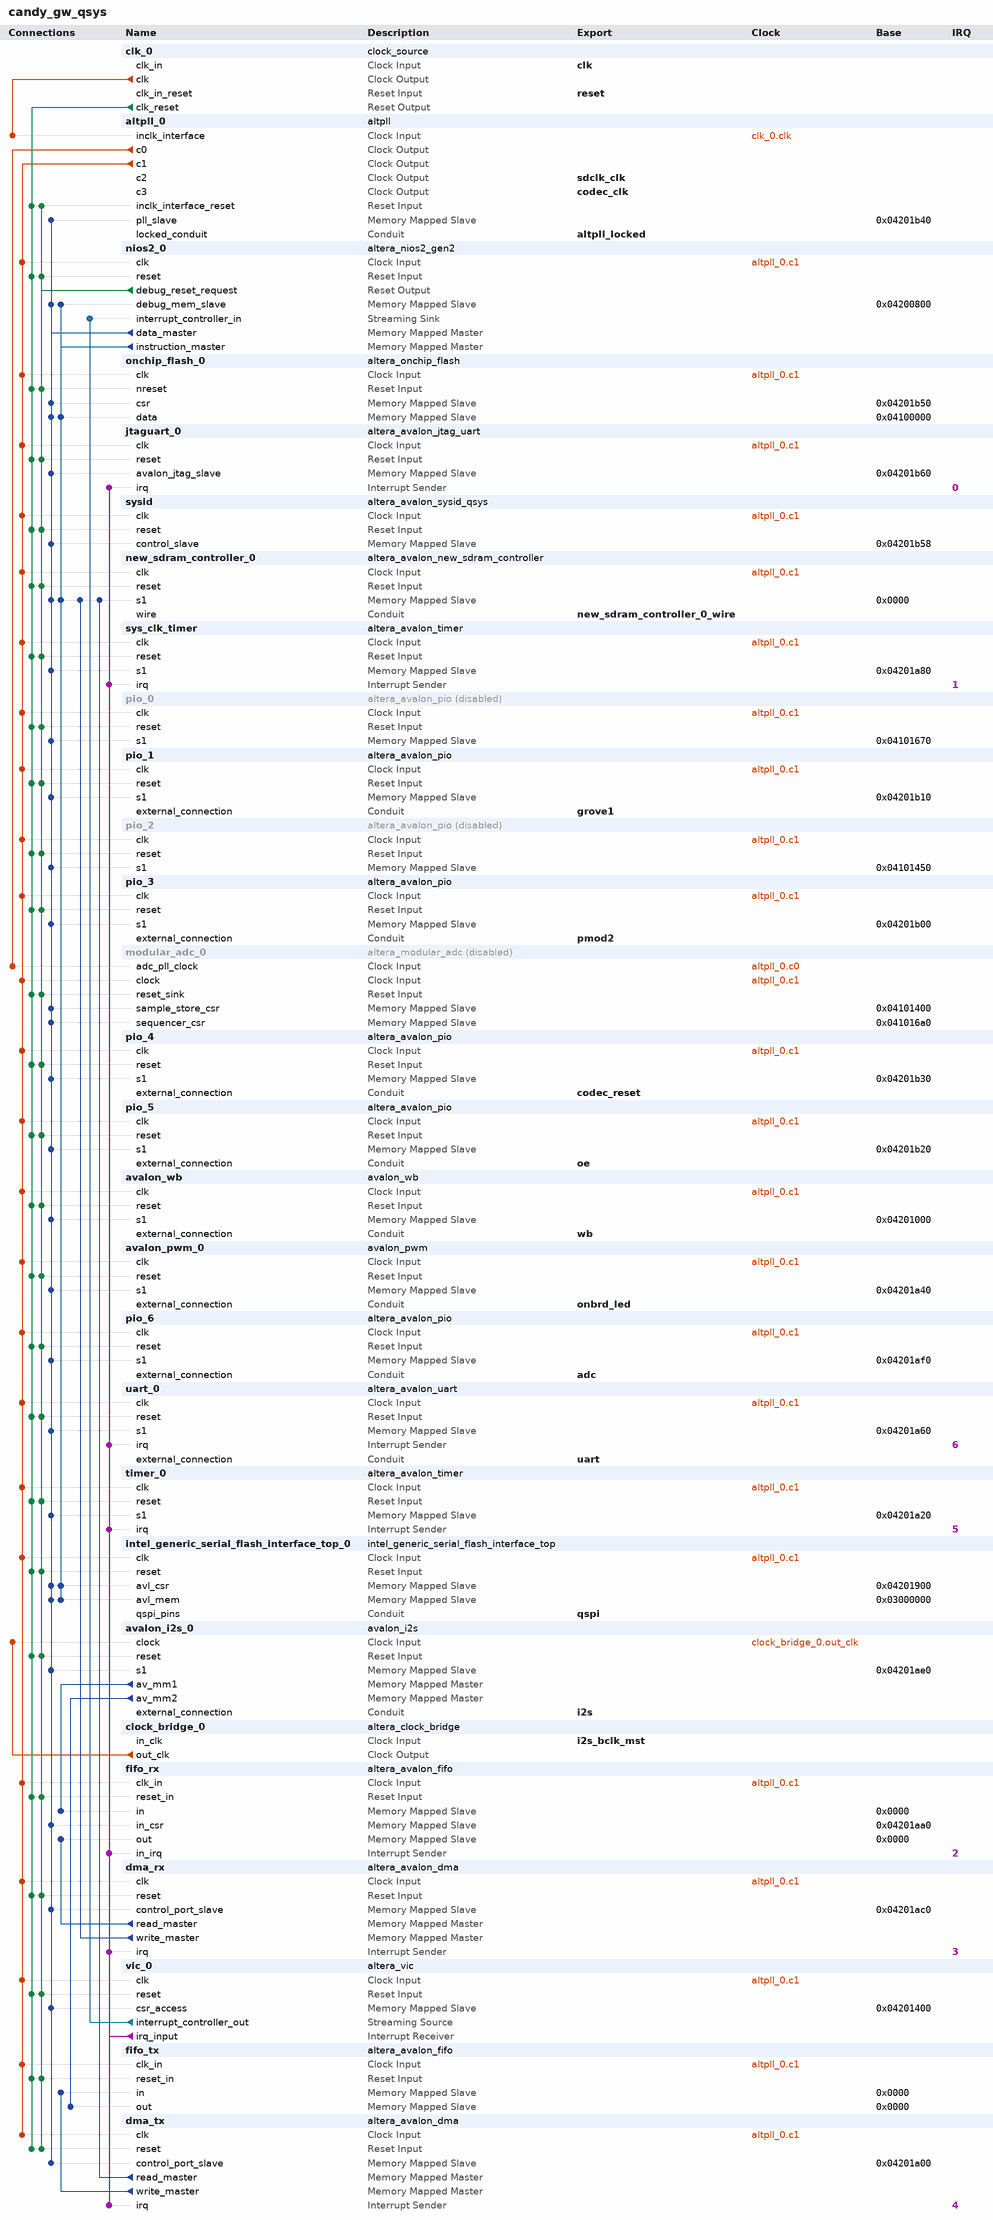
[diagram p0: system contents]
# Platform Designer (Qsys) system candy_gw_qsys, MAX 10 10M16SAU169C8G
# Parameters at their usual value, and those the tool derives, are not listed.
package require -exact qsys 18.1
create_system candy_gw_qsys
set_project_property DEVICE_FAMILY {MAX 10}
set_project_property DEVICE 10M16SAU169C8G

add_instance clk_0 clock_source 18.1
set_instance_parameter_value clk_0 clockFrequency 48000000

add_instance altpll_0 altpll 18.1
set_instance_parameter_value altpll_0 CLK0_DIVIDE_BY 24
set_instance_parameter_value altpll_0 CLK0_MULTIPLY_BY 5
set_instance_parameter_value altpll_0 CLK1_DIVIDE_BY 12
set_instance_parameter_value altpll_0 CLK1_DUTY_CYCLE 50
set_instance_parameter_value altpll_0 CLK1_MULTIPLY_BY 25
set_instance_parameter_value altpll_0 CLK1_PHASE_SHIFT 0
set_instance_parameter_value altpll_0 CLK2_DIVIDE_BY 12
set_instance_parameter_value altpll_0 CLK2_DUTY_CYCLE 50
set_instance_parameter_value altpll_0 CLK2_MULTIPLY_BY 25
set_instance_parameter_value altpll_0 CLK2_PHASE_SHIFT -83333
set_instance_parameter_value altpll_0 CLK3_DIVIDE_BY 6
set_instance_parameter_value altpll_0 CLK3_DUTY_CYCLE 50
set_instance_parameter_value altpll_0 CLK3_MULTIPLY_BY 1
set_instance_parameter_value altpll_0 CLK3_PHASE_SHIFT 0
set_instance_parameter_value altpll_0 CLK4_DIVIDE_BY 4
set_instance_parameter_value altpll_0 CLK4_DUTY_CYCLE 50
set_instance_parameter_value altpll_0 CLK4_MULTIPLY_BY 1
set_instance_parameter_value altpll_0 CLK4_PHASE_SHIFT 0
set_instance_parameter_value altpll_0 INCLK0_INPUT_FREQUENCY 20833
set_instance_parameter_value altpll_0 PORT_ARESET PORT_UNUSED
set_instance_parameter_value altpll_0 PORT_LOCKED PORT_USED
set_instance_parameter_value altpll_0 PORT_clk1 PORT_USED
set_instance_parameter_value altpll_0 PORT_clk2 PORT_USED
set_instance_parameter_value altpll_0 PORT_clk3 PORT_USED

add_instance nios2_0 altera_nios2_gen2 18.1
set_instance_parameter_value nios2_0 dcache_size 2048
set_instance_parameter_value nios2_0 exceptionSlave new_sdram_controller_0.s1
set_instance_parameter_value nios2_0 icache_size 4096
set_instance_parameter_value nios2_0 impl Fast
set_instance_parameter_value nios2_0 resetSlave onchip_flash_0.data
set_instance_parameter_value nios2_0 setting_interruptControllerType External
set_instance_parameter_value nios2_0 setting_shadowRegisterSets 7

add_instance onchip_flash_0 altera_onchip_flash 18.1
set_instance_parameter_value onchip_flash_0 CONFIGURATION_MODE {Single Uncompressed Image}
set_instance_parameter_value onchip_flash_0 SECTOR_ACCESS_MODE {Read and write,Read and write,Read and write,Read and write,Read and write}
set_instance_parameter_value onchip_flash_0 initFlashContent false
set_instance_parameter_value onchip_flash_0 initializationFileName altera_onchip_flash.hex
set_instance_parameter_value onchip_flash_0 useNonDefaultInitFile false

add_instance jtaguart_0 altera_avalon_jtag_uart 18.1
set_instance_parameter_value jtaguart_0 simInteractiveOptions NO_INTERACTIVE_WINDOWS

add_instance sysid altera_avalon_sysid_qsys 18.1
set_instance_parameter_value sysid id 549

add_instance new_sdram_controller_0 altera_avalon_new_sdram_controller 18.1
set_instance_parameter_value new_sdram_controller_0 TAC 6.0
set_instance_parameter_value new_sdram_controller_0 TRCD 21.0
set_instance_parameter_value new_sdram_controller_0 TRFC 63.0
set_instance_parameter_value new_sdram_controller_0 TRP 21.0
set_instance_parameter_value new_sdram_controller_0 casLatency 3
set_instance_parameter_value new_sdram_controller_0 columnWidth 9
set_instance_parameter_value new_sdram_controller_0 dataWidth 16
set_instance_parameter_value new_sdram_controller_0 generateSimulationModel false
set_instance_parameter_value new_sdram_controller_0 model single_Micron_MT48LC4M32B2_7_chip
set_instance_parameter_value new_sdram_controller_0 numberOfBanks 4
set_instance_parameter_value new_sdram_controller_0 numberOfChipSelects 1
set_instance_parameter_value new_sdram_controller_0 powerUpDelay 200.0
set_instance_parameter_value new_sdram_controller_0 refreshPeriod 7.8
set_instance_parameter_value new_sdram_controller_0 rowWidth 13

add_instance sys_clk_timer altera_avalon_timer 18.1
set_instance_parameter_value sys_clk_timer fixedPeriod true
set_instance_parameter_value sys_clk_timer period 1
set_instance_parameter_value sys_clk_timer periodUnits MSEC

add_instance pio_0 altera_avalon_pio 18.1
set_instance_property pio_0 ENABLED false
set_instance_parameter_value pio_0 direction Output
set_instance_parameter_value pio_0 width 4

add_instance pio_1 altera_avalon_pio 18.1
set_instance_parameter_value pio_1 direction InOut
set_instance_parameter_value pio_1 width 2

add_instance pio_2 altera_avalon_pio 18.1
set_instance_property pio_2 ENABLED false
set_instance_parameter_value pio_2 direction Output
set_instance_parameter_value pio_2 width 4

add_instance pio_3 altera_avalon_pio 18.1
set_instance_parameter_value pio_3 direction Input
set_instance_parameter_value pio_3 width 4

add_instance modular_adc_0 altera_modular_adc 18.1
set_instance_property modular_adc_0 ENABLED false
set_instance_parameter_value modular_adc_0 CLOCK_FREQ 100000000
set_instance_parameter_value modular_adc_0 CORE_VAR 0
set_instance_parameter_value modular_adc_0 DEVICE_PART 10M16SAU169C8G
set_instance_parameter_value modular_adc_0 clkdiv 2
set_instance_parameter_value modular_adc_0 int_vref_vr 3.3
set_instance_parameter_value modular_adc_0 refsel 1
set_instance_parameter_value modular_adc_0 sample_rate 0
set_instance_parameter_value modular_adc_0 seq_order_length 1
set_instance_parameter_value modular_adc_0 seq_order_slot_1 0
set_instance_parameter_value modular_adc_0 seq_order_slot_2 30
set_instance_parameter_value modular_adc_0 seq_order_slot_3 30
set_instance_parameter_value modular_adc_0 seq_order_slot_4 30
set_instance_parameter_value modular_adc_0 seq_order_slot_5 30
set_instance_parameter_value modular_adc_0 seq_order_slot_6 30
set_instance_parameter_value modular_adc_0 seq_order_slot_7 30
set_instance_parameter_value modular_adc_0 use_ch0 true
set_instance_parameter_value modular_adc_0 use_ch2 true
set_instance_parameter_value modular_adc_0 use_ch3 true
set_instance_parameter_value modular_adc_0 use_ch4 true
set_instance_parameter_value modular_adc_0 use_ch5 true
set_instance_parameter_value modular_adc_0 use_ch6 true
set_instance_parameter_value modular_adc_0 use_ch7 true
set_instance_parameter_value modular_adc_0 use_ch8 true
set_instance_parameter_value modular_adc_0 use_tsd false

add_instance pio_4 altera_avalon_pio 18.1
set_instance_parameter_value pio_4 direction Output
set_instance_parameter_value pio_4 width 1

add_instance pio_5 altera_avalon_pio 18.1
set_instance_parameter_value pio_5 direction Output
set_instance_parameter_value pio_5 width 1

add_instance avalon_wb avalon_wb 1.0

add_instance avalon_pwm_0 avalon_pwm 1.0
set_instance_parameter_value avalon_pwm_0 PWM_COUNTER_MAX 60000
set_instance_parameter_value avalon_pwm_0 WIDTH 3

add_instance pio_6 altera_avalon_pio 18.1
set_instance_parameter_value pio_6 direction Input
set_instance_parameter_value pio_6 width 8

add_instance uart_0 altera_avalon_uart 18.1
set_instance_parameter_value uart_0 baud 115200
set_instance_parameter_value uart_0 dataBits 8
set_instance_parameter_value uart_0 fixedBaud true
set_instance_parameter_value uart_0 parity NONE
set_instance_parameter_value uart_0 stopBits 1
set_instance_parameter_value uart_0 useCtsRts true

add_instance timer_0 altera_avalon_timer 18.1
set_instance_parameter_value timer_0 period 1
set_instance_parameter_value timer_0 periodUnits USEC

add_instance intel_generic_serial_flash_interface_top_0 intel_generic_serial_flash_interface_top 18.1
set_instance_parameter_value intel_generic_serial_flash_interface_top_0 CHIP_SELECT_BYPASS false
set_instance_parameter_value intel_generic_serial_flash_interface_top_0 CHIP_SELS 1
set_instance_parameter_value intel_generic_serial_flash_interface_top_0 DEBUG_OPTION 0
set_instance_parameter_value intel_generic_serial_flash_interface_top_0 DEFAULT_VALUE_REG_0 1
set_instance_parameter_value intel_generic_serial_flash_interface_top_0 DEFAULT_VALUE_REG_1 16
set_instance_parameter_value intel_generic_serial_flash_interface_top_0 DEFAULT_VALUE_REG_2 0
set_instance_parameter_value intel_generic_serial_flash_interface_top_0 DEFAULT_VALUE_REG_3 0
set_instance_parameter_value intel_generic_serial_flash_interface_top_0 DEFAULT_VALUE_REG_4 0
set_instance_parameter_value intel_generic_serial_flash_interface_top_0 DEFAULT_VALUE_REG_5 3
set_instance_parameter_value intel_generic_serial_flash_interface_top_0 DEFAULT_VALUE_REG_6 28674
set_instance_parameter_value intel_generic_serial_flash_interface_top_0 DEFAULT_VALUE_REG_7 6149
set_instance_parameter_value intel_generic_serial_flash_interface_top_0 DEVICE_DENSITY 128
set_instance_parameter_value intel_generic_serial_flash_interface_top_0 ENABLE_SIM_MODEL false
set_instance_parameter_value intel_generic_serial_flash_interface_top_0 PIPE_CMD_GEN_CMD 0
set_instance_parameter_value intel_generic_serial_flash_interface_top_0 PIPE_CSR 0
set_instance_parameter_value intel_generic_serial_flash_interface_top_0 PIPE_MUX_CMD 0
set_instance_parameter_value intel_generic_serial_flash_interface_top_0 PIPE_XIP 0
set_instance_parameter_value intel_generic_serial_flash_interface_top_0 USE_CHIP_SEL_FROM_CSR 1
set_instance_parameter_value intel_generic_serial_flash_interface_top_0 gui_use_asmiblock false
set_instance_parameter_value intel_generic_serial_flash_interface_top_0 gui_use_gpio true

add_instance avalon_i2s_0 avalon_i2s 0.1
set_instance_parameter_value avalon_i2s_0 DATA_WIDTH 32

add_instance clock_bridge_0 altera_clock_bridge 18.1
set_instance_parameter_value clock_bridge_0 DERIVED_CLOCK_RATE 0
set_instance_parameter_value clock_bridge_0 EXPLICIT_CLOCK_RATE 0

add_instance fifo_rx altera_avalon_fifo 18.1
set_instance_parameter_value fifo_rx bitsPerSymbol 8
set_instance_parameter_value fifo_rx channelWidth 0
set_instance_parameter_value fifo_rx errorWidth 0
set_instance_parameter_value fifo_rx fifoDepth 1024
set_instance_parameter_value fifo_rx fifoInputInterfaceOptions AVALONMM_WRITE
set_instance_parameter_value fifo_rx fifoOutputInterfaceOptions AVALONMM_READ
set_instance_parameter_value fifo_rx singleClockMode true
set_instance_parameter_value fifo_rx symbolsPerBeat 4
set_instance_parameter_value fifo_rx useBackpressure false
set_instance_parameter_value fifo_rx useIRQ true
set_instance_parameter_value fifo_rx usePacket false
set_instance_parameter_value fifo_rx useReadControl false

add_instance dma_rx altera_avalon_dma 18.1
set_instance_parameter_value dma_rx allowByteTransactions true
set_instance_parameter_value dma_rx allowDoubleWordTransactions true
set_instance_parameter_value dma_rx allowHalfWordTransactions true
set_instance_parameter_value dma_rx allowQuadWordTransactions true
set_instance_parameter_value dma_rx burstEnable false
set_instance_parameter_value dma_rx fifoDepth 2048
set_instance_parameter_value dma_rx maxBurstSize 128
set_instance_parameter_value dma_rx minimumDmaTransactionRegisterWidth 13

add_instance vic_0 altera_vic 18.1
set_instance_parameter_value vic_0 DAISY_CHAIN_ENABLE 0
set_instance_parameter_value vic_0 INTERRUPT_LATENCY_CYCLES 2
set_instance_parameter_value vic_0 NUMBER_OF_INT_PORTS 7
set_instance_parameter_value vic_0 OVERRIDE_INTERRUPT_LATENCY false
set_instance_parameter_value vic_0 RIL_WIDTH 6

add_instance fifo_tx altera_avalon_fifo 18.1
set_instance_parameter_value fifo_tx bitsPerSymbol 8
set_instance_parameter_value fifo_tx channelWidth 0
set_instance_parameter_value fifo_tx errorWidth 0
set_instance_parameter_value fifo_tx fifoDepth 1024
set_instance_parameter_value fifo_tx fifoInputInterfaceOptions AVALONMM_WRITE
set_instance_parameter_value fifo_tx fifoOutputInterfaceOptions AVALONMM_READ
set_instance_parameter_value fifo_tx singleClockMode true
set_instance_parameter_value fifo_tx symbolsPerBeat 4
set_instance_parameter_value fifo_tx useBackpressure false
set_instance_parameter_value fifo_tx useIRQ true
set_instance_parameter_value fifo_tx usePacket false
set_instance_parameter_value fifo_tx useReadControl false
set_instance_parameter_value fifo_tx useWriteControl false

add_instance dma_tx altera_avalon_dma 18.1
set_instance_parameter_value dma_tx allowByteTransactions true
set_instance_parameter_value dma_tx allowDoubleWordTransactions true
set_instance_parameter_value dma_tx allowHalfWordTransactions true
set_instance_parameter_value dma_tx allowQuadWordTransactions true
set_instance_parameter_value dma_tx burstEnable false
set_instance_parameter_value dma_tx fifoDepth 2048
set_instance_parameter_value dma_tx maxBurstSize 128
set_instance_parameter_value dma_tx minimumDmaTransactionRegisterWidth 13

# connections
add_connection altpll_0.c0 modular_adc_0.adc_pll_clock clock
add_connection altpll_0.c1 avalon_pwm_0.clk clock
add_connection altpll_0.c1 avalon_wb.clk clock
add_connection altpll_0.c1 dma_rx.clk clock
add_connection altpll_0.c1 dma_tx.clk clock
add_connection altpll_0.c1 fifo_rx.clk_in clock
add_connection altpll_0.c1 fifo_tx.clk_in clock
add_connection altpll_0.c1 intel_generic_serial_flash_interface_top_0.clk clock
add_connection altpll_0.c1 jtaguart_0.clk clock
add_connection altpll_0.c1 modular_adc_0.clock clock
add_connection altpll_0.c1 new_sdram_controller_0.clk clock
add_connection altpll_0.c1 nios2_0.clk clock
add_connection altpll_0.c1 onchip_flash_0.clk clock
add_connection altpll_0.c1 pio_0.clk clock
add_connection altpll_0.c1 pio_1.clk clock
add_connection altpll_0.c1 pio_2.clk clock
add_connection altpll_0.c1 pio_3.clk clock
add_connection altpll_0.c1 pio_4.clk clock
add_connection altpll_0.c1 pio_5.clk clock
add_connection altpll_0.c1 pio_6.clk clock
add_connection altpll_0.c1 sys_clk_timer.clk clock
add_connection altpll_0.c1 sysid.clk clock
add_connection altpll_0.c1 timer_0.clk clock
add_connection altpll_0.c1 uart_0.clk clock
add_connection altpll_0.c1 vic_0.clk clock
add_connection clk_0.clk altpll_0.inclk_interface clock
add_connection clock_bridge_0.out_clk avalon_i2s_0.clock clock
add_connection clk_0.clk_reset altpll_0.inclk_interface_reset reset
add_connection clk_0.clk_reset avalon_i2s_0.reset reset
add_connection clk_0.clk_reset avalon_pwm_0.reset reset
add_connection clk_0.clk_reset avalon_wb.reset reset
add_connection clk_0.clk_reset dma_rx.reset reset
add_connection clk_0.clk_reset dma_tx.reset reset
add_connection clk_0.clk_reset fifo_rx.reset_in reset
add_connection clk_0.clk_reset fifo_tx.reset_in reset
add_connection clk_0.clk_reset intel_generic_serial_flash_interface_top_0.reset reset
add_connection clk_0.clk_reset jtaguart_0.reset reset
add_connection clk_0.clk_reset modular_adc_0.reset_sink reset
add_connection clk_0.clk_reset new_sdram_controller_0.reset reset
add_connection clk_0.clk_reset nios2_0.reset reset
add_connection clk_0.clk_reset onchip_flash_0.nreset reset
add_connection clk_0.clk_reset pio_0.reset reset
add_connection clk_0.clk_reset pio_1.reset reset
add_connection clk_0.clk_reset pio_2.reset reset
add_connection clk_0.clk_reset pio_3.reset reset
add_connection clk_0.clk_reset pio_4.reset reset
add_connection clk_0.clk_reset pio_5.reset reset
add_connection clk_0.clk_reset pio_6.reset reset
add_connection clk_0.clk_reset sys_clk_timer.reset reset
add_connection clk_0.clk_reset sysid.reset reset
add_connection clk_0.clk_reset timer_0.reset reset
add_connection clk_0.clk_reset uart_0.reset reset
add_connection clk_0.clk_reset vic_0.reset reset
add_connection nios2_0.debug_reset_request altpll_0.inclk_interface_reset reset
add_connection nios2_0.debug_reset_request avalon_i2s_0.reset reset
add_connection nios2_0.debug_reset_request avalon_pwm_0.reset reset
add_connection nios2_0.debug_reset_request avalon_wb.reset reset
add_connection nios2_0.debug_reset_request dma_rx.reset reset
add_connection nios2_0.debug_reset_request dma_tx.reset reset
add_connection nios2_0.debug_reset_request fifo_rx.reset_in reset
add_connection nios2_0.debug_reset_request fifo_tx.reset_in reset
add_connection nios2_0.debug_reset_request intel_generic_serial_flash_interface_top_0.reset reset
add_connection nios2_0.debug_reset_request jtaguart_0.reset reset
add_connection nios2_0.debug_reset_request modular_adc_0.reset_sink reset
add_connection nios2_0.debug_reset_request new_sdram_controller_0.reset reset
add_connection nios2_0.debug_reset_request nios2_0.reset reset
add_connection nios2_0.debug_reset_request onchip_flash_0.nreset reset
add_connection nios2_0.debug_reset_request pio_0.reset reset
add_connection nios2_0.debug_reset_request pio_1.reset reset
add_connection nios2_0.debug_reset_request pio_2.reset reset
add_connection nios2_0.debug_reset_request pio_3.reset reset
add_connection nios2_0.debug_reset_request pio_4.reset reset
add_connection nios2_0.debug_reset_request pio_5.reset reset
add_connection nios2_0.debug_reset_request pio_6.reset reset
add_connection nios2_0.debug_reset_request sys_clk_timer.reset reset
add_connection nios2_0.debug_reset_request sysid.reset reset
add_connection nios2_0.debug_reset_request timer_0.reset reset
add_connection nios2_0.debug_reset_request uart_0.reset reset
add_connection nios2_0.debug_reset_request vic_0.reset reset
add_connection avalon_i2s_0.av_mm1 fifo_rx.in avalon
set_connection_parameter_value avalon_i2s_0.av_mm1/fifo_rx.in baseAddress 0x0000
add_connection avalon_i2s_0.av_mm2 fifo_tx.out avalon
set_connection_parameter_value avalon_i2s_0.av_mm2/fifo_tx.out baseAddress 0x0000
add_connection dma_rx.read_master fifo_rx.out avalon
set_connection_parameter_value dma_rx.read_master/fifo_rx.out baseAddress 0x0000
add_connection dma_rx.write_master new_sdram_controller_0.s1 avalon
set_connection_parameter_value dma_rx.write_master/new_sdram_controller_0.s1 baseAddress 0x0000
add_connection dma_tx.read_master new_sdram_controller_0.s1 avalon
set_connection_parameter_value dma_tx.read_master/new_sdram_controller_0.s1 baseAddress 0x0000
add_connection dma_tx.write_master fifo_tx.in avalon
set_connection_parameter_value dma_tx.write_master/fifo_tx.in baseAddress 0x0000
add_connection nios2_0.data_master altpll_0.pll_slave avalon
set_connection_parameter_value nios2_0.data_master/altpll_0.pll_slave baseAddress 0x04201b40
add_connection nios2_0.data_master avalon_i2s_0.s1 avalon
set_connection_parameter_value nios2_0.data_master/avalon_i2s_0.s1 baseAddress 0x04201ae0
add_connection nios2_0.data_master avalon_pwm_0.s1 avalon
set_connection_parameter_value nios2_0.data_master/avalon_pwm_0.s1 baseAddress 0x04201a40
add_connection nios2_0.data_master avalon_wb.s1 avalon
set_connection_parameter_value nios2_0.data_master/avalon_wb.s1 baseAddress 0x04201000
add_connection nios2_0.data_master dma_rx.control_port_slave avalon
set_connection_parameter_value nios2_0.data_master/dma_rx.control_port_slave baseAddress 0x04201ac0
add_connection nios2_0.data_master dma_tx.control_port_slave avalon
set_connection_parameter_value nios2_0.data_master/dma_tx.control_port_slave baseAddress 0x04201a00
add_connection nios2_0.data_master fifo_rx.in_csr avalon
set_connection_parameter_value nios2_0.data_master/fifo_rx.in_csr baseAddress 0x04201aa0
add_connection nios2_0.data_master intel_generic_serial_flash_interface_top_0.avl_csr avalon
set_connection_parameter_value nios2_0.data_master/intel_generic_serial_flash_interface_top_0.avl_csr baseAddress 0x04201900
add_connection nios2_0.data_master intel_generic_serial_flash_interface_top_0.avl_mem avalon
set_connection_parameter_value nios2_0.data_master/intel_generic_serial_flash_interface_top_0.avl_mem baseAddress 0x03000000
add_connection nios2_0.data_master jtaguart_0.avalon_jtag_slave avalon
set_connection_parameter_value nios2_0.data_master/jtaguart_0.avalon_jtag_slave baseAddress 0x04201b60
add_connection nios2_0.data_master modular_adc_0.sample_store_csr avalon
set_connection_parameter_value nios2_0.data_master/modular_adc_0.sample_store_csr baseAddress 0x04101400
add_connection nios2_0.data_master modular_adc_0.sequencer_csr avalon
set_connection_parameter_value nios2_0.data_master/modular_adc_0.sequencer_csr baseAddress 0x041016a0
add_connection nios2_0.data_master new_sdram_controller_0.s1 avalon
set_connection_parameter_value nios2_0.data_master/new_sdram_controller_0.s1 baseAddress 0x0000
add_connection nios2_0.data_master nios2_0.debug_mem_slave avalon
set_connection_parameter_value nios2_0.data_master/nios2_0.debug_mem_slave baseAddress 0x04200800
add_connection nios2_0.data_master onchip_flash_0.csr avalon
set_connection_parameter_value nios2_0.data_master/onchip_flash_0.csr baseAddress 0x04201b50
add_connection nios2_0.data_master onchip_flash_0.data avalon
set_connection_parameter_value nios2_0.data_master/onchip_flash_0.data baseAddress 0x04100000
add_connection nios2_0.data_master pio_0.s1 avalon
set_connection_parameter_value nios2_0.data_master/pio_0.s1 baseAddress 0x04101670
add_connection nios2_0.data_master pio_1.s1 avalon
set_connection_parameter_value nios2_0.data_master/pio_1.s1 baseAddress 0x04201b10
add_connection nios2_0.data_master pio_2.s1 avalon
set_connection_parameter_value nios2_0.data_master/pio_2.s1 baseAddress 0x04101450
add_connection nios2_0.data_master pio_3.s1 avalon
set_connection_parameter_value nios2_0.data_master/pio_3.s1 baseAddress 0x04201b00
add_connection nios2_0.data_master pio_4.s1 avalon
set_connection_parameter_value nios2_0.data_master/pio_4.s1 baseAddress 0x04201b30
add_connection nios2_0.data_master pio_5.s1 avalon
set_connection_parameter_value nios2_0.data_master/pio_5.s1 baseAddress 0x04201b20
add_connection nios2_0.data_master pio_6.s1 avalon
set_connection_parameter_value nios2_0.data_master/pio_6.s1 baseAddress 0x04201af0
add_connection nios2_0.data_master sys_clk_timer.s1 avalon
set_connection_parameter_value nios2_0.data_master/sys_clk_timer.s1 baseAddress 0x04201a80
add_connection nios2_0.data_master sysid.control_slave avalon
set_connection_parameter_value nios2_0.data_master/sysid.control_slave baseAddress 0x04201b58
add_connection nios2_0.data_master timer_0.s1 avalon
set_connection_parameter_value nios2_0.data_master/timer_0.s1 baseAddress 0x04201a20
add_connection nios2_0.data_master uart_0.s1 avalon
set_connection_parameter_value nios2_0.data_master/uart_0.s1 baseAddress 0x04201a60
add_connection nios2_0.data_master vic_0.csr_access avalon
set_connection_parameter_value nios2_0.data_master/vic_0.csr_access baseAddress 0x04201400
add_connection nios2_0.instruction_master intel_generic_serial_flash_interface_top_0.avl_csr avalon
set_connection_parameter_value nios2_0.instruction_master/intel_generic_serial_flash_interface_top_0.avl_csr baseAddress 0x04201900
add_connection nios2_0.instruction_master intel_generic_serial_flash_interface_top_0.avl_mem avalon
set_connection_parameter_value nios2_0.instruction_master/intel_generic_serial_flash_interface_top_0.avl_mem baseAddress 0x03000000
add_connection nios2_0.instruction_master new_sdram_controller_0.s1 avalon
set_connection_parameter_value nios2_0.instruction_master/new_sdram_controller_0.s1 baseAddress 0x0000
add_connection nios2_0.instruction_master nios2_0.debug_mem_slave avalon
set_connection_parameter_value nios2_0.instruction_master/nios2_0.debug_mem_slave baseAddress 0x04200800
add_connection nios2_0.instruction_master onchip_flash_0.data avalon
set_connection_parameter_value nios2_0.instruction_master/onchip_flash_0.data baseAddress 0x04100000
add_connection vic_0.interrupt_controller_out nios2_0.interrupt_controller_in avalon_streaming
add_connection vic_0.irq_input dma_rx.irq interrupt
set_connection_parameter_value vic_0.irq_input/dma_rx.irq irqNumber 3
add_connection vic_0.irq_input dma_tx.irq interrupt
set_connection_parameter_value vic_0.irq_input/dma_tx.irq irqNumber 4
add_connection vic_0.irq_input fifo_rx.in_irq interrupt
set_connection_parameter_value vic_0.irq_input/fifo_rx.in_irq irqNumber 2
add_connection vic_0.irq_input jtaguart_0.irq interrupt
set_connection_parameter_value vic_0.irq_input/jtaguart_0.irq irqNumber 0
add_connection vic_0.irq_input sys_clk_timer.irq interrupt
set_connection_parameter_value vic_0.irq_input/sys_clk_timer.irq irqNumber 1
add_connection vic_0.irq_input timer_0.irq interrupt
set_connection_parameter_value vic_0.irq_input/timer_0.irq irqNumber 5
add_connection vic_0.irq_input uart_0.irq interrupt
set_connection_parameter_value vic_0.irq_input/uart_0.irq irqNumber 6

# exported interfaces
add_interface adc conduit end
set_interface_property adc EXPORT_OF pio_6.external_connection
add_interface altpll_locked conduit end
set_interface_property altpll_locked EXPORT_OF altpll_0.locked_conduit
add_interface clk clock sink
set_interface_property clk EXPORT_OF clk_0.clk_in
add_interface codec_clk clock source
set_interface_property codec_clk EXPORT_OF altpll_0.c3
add_interface codec_reset conduit end
set_interface_property codec_reset EXPORT_OF pio_4.external_connection
add_interface grove1 conduit end
set_interface_property grove1 EXPORT_OF pio_1.external_connection
add_interface i2s conduit end
set_interface_property i2s EXPORT_OF avalon_i2s_0.external_connection
add_interface i2s_bclk_mst clock sink
set_interface_property i2s_bclk_mst EXPORT_OF clock_bridge_0.in_clk
add_interface new_sdram_controller_0_wire conduit end
set_interface_property new_sdram_controller_0_wire EXPORT_OF new_sdram_controller_0.wire
add_interface oe conduit end
set_interface_property oe EXPORT_OF pio_5.external_connection
add_interface onbrd_led conduit end
set_interface_property onbrd_led EXPORT_OF avalon_pwm_0.external_connection
add_interface pmod2 conduit end
set_interface_property pmod2 EXPORT_OF pio_3.external_connection
add_interface qspi conduit end
set_interface_property qspi EXPORT_OF intel_generic_serial_flash_interface_top_0.qspi_pins
add_interface reset reset sink
set_interface_property reset EXPORT_OF clk_0.clk_in_reset
add_interface sdclk_clk clock source
set_interface_property sdclk_clk EXPORT_OF altpll_0.c2
add_interface uart conduit end
set_interface_property uart EXPORT_OF uart_0.external_connection
add_interface wb conduit end
set_interface_property wb EXPORT_OF avalon_wb.external_connection

set_interconnect_requirement {$system} qsys_mm.clockCrossingAdapter HANDSHAKE
set_interconnect_requirement {$system} qsys_mm.enableEccProtection FALSE
set_interconnect_requirement {$system} qsys_mm.insertDefaultSlave FALSE
set_interconnect_requirement {$system} qsys_mm.maxAdditionalLatency 1

save_system candy_gw_qsys.qsys
